# Altium schematic sheet ESP8266_base5.1.SchDoc
size A
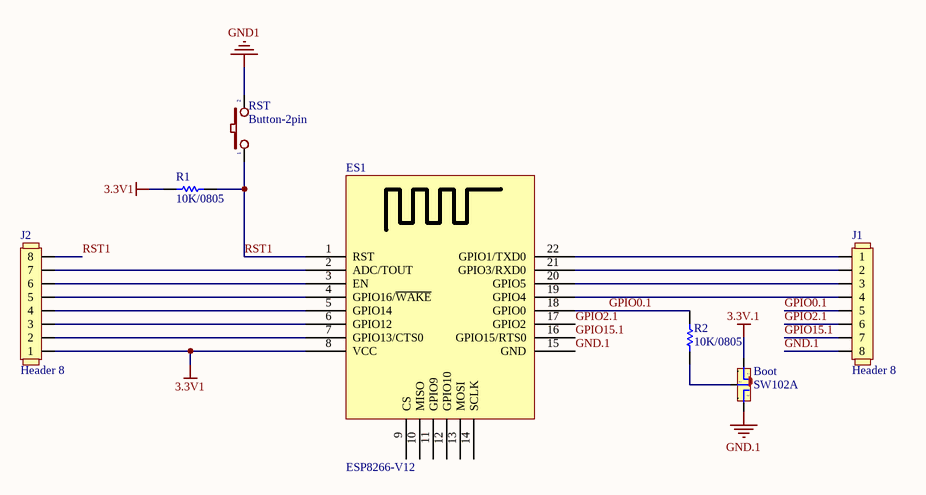
[diagram p0: ESP8266_base5.1.SchDoc]

## Parts
Boot  SW102A  [SW102]
ES1  ESP8266-V12  [ESP-8266 V12]
J1  Header 8  [HEADER x8]
J2  Header 8  [HEADER x8]
R1  10K/0805  [Res 0805(2012)]
R2  10K/0805  [Res 0805(2012)]
RST  Button-2pin  [BUTTON_2P_SMD]

## Nets
3.3V1: ES1.8(VCC) J2.1 R1.2
3.3V.1: Boot.1
GND1: RST.2
GND.1: Boot.3 ES1.15(GND) J1.8
GPIO0.1: ES1.18(GPIO0) J1.5 R2.1
GPIO2.1: ES1.17(GPIO2) J1.6
GPIO15.1: ES1.16(GPIO15/RTS0) J1.7
RST1: ES1.1(RST) J2.8 R1.1 RST.1
NetBoot_2: Boot.2 R2.2
NetES1_2: ES1.2(ADC/TOUT) J2.7
NetES1_3: ES1.3(EN) J2.6
NetES1_4: ES1.4(GPIO16/~{WAKE}) J2.5
NetES1_5: ES1.5(GPIO14) J2.4
NetES1_6: ES1.6(GPIO12) J2.3
NetES1_7: ES1.7(GPIO13/CTS0) J2.2
NetES1_19: ES1.19(GPIO4) J1.4
NetES1_20: ES1.20(GPIO5) J1.3
NetES1_21: ES1.21(GPIO3/RXD0) J1.2
NetES1_22: ES1.22(GPIO1/TXD0) J1.1

Not connected (* = marked no-connect by the designer): Boot 4 5; ES1 9(CS) 10(MISO) 11(GPIO9) 12(GPIO10) 13(MOSI) 14(SCLK)

## Library data of the parts
Boot = SW102A: Switch 102 on Broad; Value: Switch 102 On Board
R1 R2 = Resistor 0805